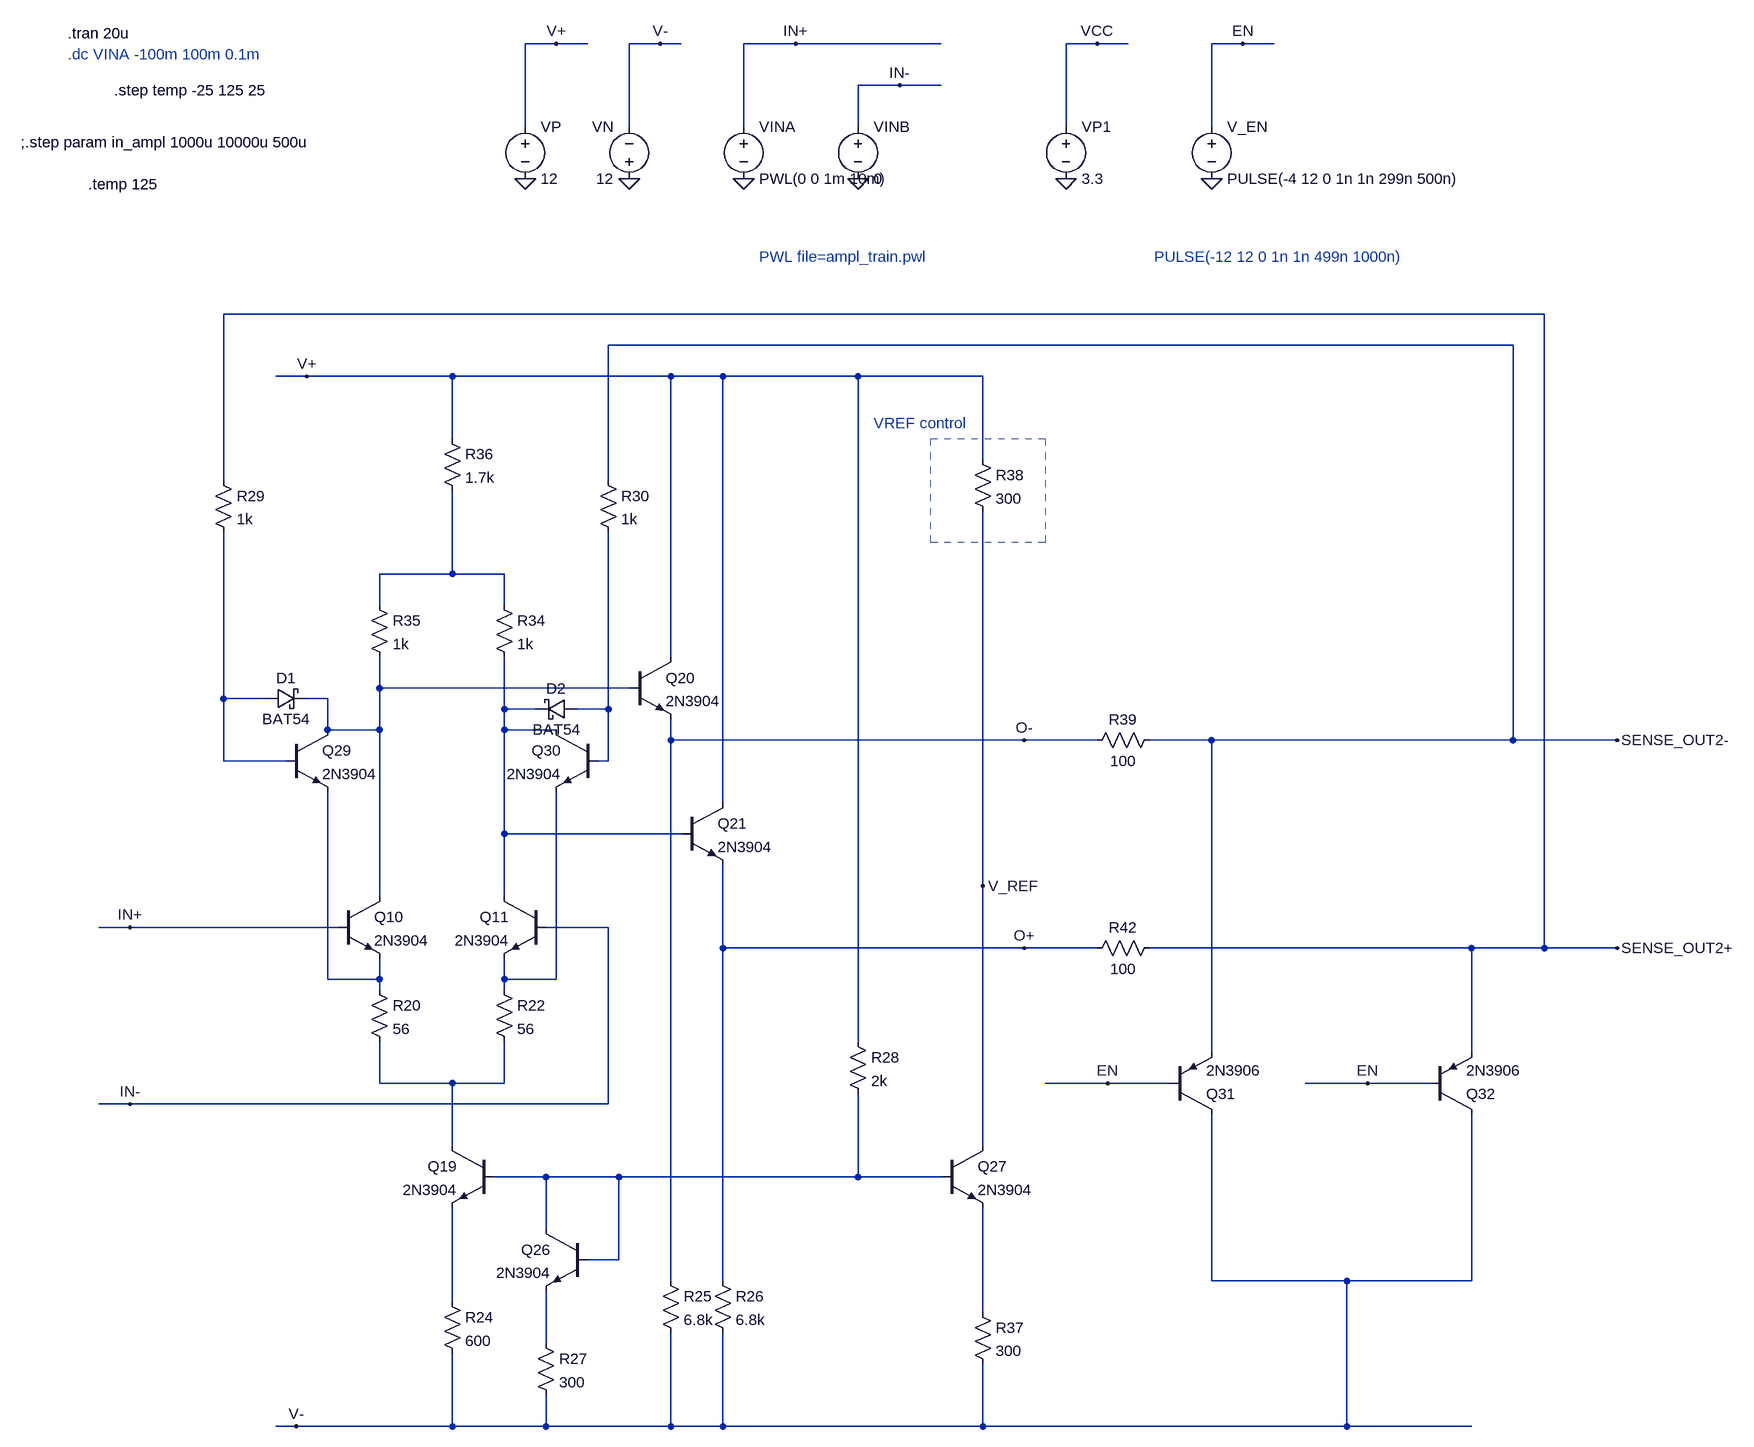
[diagram p0: schematic rom_sense_amp.asc]
rom_sense_amp.asc, the LTspice schematic file:
Version 4.1
SHEET 1 4868 3272
WIRE 448 992 400 992
WIRE 496 992 448 992
WIRE 608 992 560 992
WIRE 640 992 608 992
WIRE 816 992 736 992
WIRE 1040 992 816 992
WIRE 1280 992 1232 992
WIRE 1328 992 1280 992
WIRE 1504 992 1456 992
WIRE 1552 992 1504 992
WIRE 976 1056 912 1056
WIRE 1040 1056 976 1056
WIRE 400 1120 400 992
WIRE 560 1120 560 992
WIRE 736 1120 736 992
WIRE 912 1120 912 1056
WIRE 1232 1120 1232 992
WIRE 1456 1120 1456 992
WIRE 1968 1408 -64 1408
WIRE 1920 1456 528 1456
WIRE 64 1504 16 1504
WIRE 288 1504 64 1504
WIRE 624 1504 288 1504
WIRE 704 1504 624 1504
WIRE 912 1504 704 1504
WIRE 1104 1504 912 1504
WIRE 288 1600 288 1504
WIRE 1104 1632 1104 1504
WIRE -64 1664 -64 1408
WIRE 528 1664 528 1456
WIRE 288 1808 288 1680
WIRE 288 1808 176 1808
WIRE 368 1808 288 1808
WIRE 176 1856 176 1808
WIRE 368 1856 368 1808
WIRE 624 1936 624 1504
WIRE 176 1984 176 1936
WIRE 560 1984 176 1984
WIRE -64 2000 -64 1744
WIRE 0 2000 -64 2000
WIRE 96 2000 64 2000
WIRE 368 2016 368 1936
WIRE 416 2016 368 2016
WIRE 528 2016 528 1744
WIRE 528 2016 480 2016
WIRE 96 2048 96 2000
WIRE 176 2048 176 1984
WIRE 176 2048 96 2048
WIRE 368 2048 368 2016
WIRE 448 2048 368 2048
WIRE 624 2064 624 2032
WIRE 1168 2064 624 2064
WIRE 1280 2064 1168 2064
WIRE 1456 2064 1360 2064
WIRE 1920 2064 1920 1456
WIRE 1920 2064 1456 2064
WIRE 2080 2064 1920 2064
WIRE -64 2096 -64 2000
WIRE 32 2096 -64 2096
WIRE 528 2096 528 2016
WIRE 528 2096 512 2096
WIRE 704 2160 704 1504
WIRE 368 2208 368 2048
WIRE 640 2208 368 2208
WIRE 1104 2288 1104 1712
WIRE 176 2304 176 2048
WIRE 368 2304 368 2208
WIRE -208 2352 -256 2352
WIRE 112 2352 -208 2352
WIRE 528 2352 432 2352
WIRE 704 2384 704 2256
WIRE 1168 2384 704 2384
WIRE 1280 2384 1168 2384
WIRE 1856 2384 1360 2384
WIRE 1968 2384 1968 1408
WIRE 1968 2384 1856 2384
WIRE 2080 2384 1968 2384
WIRE 96 2432 96 2144
WIRE 176 2432 176 2400
WIRE 176 2432 96 2432
WIRE 368 2432 368 2400
WIRE 448 2432 448 2144
WIRE 448 2432 368 2432
WIRE 176 2448 176 2432
WIRE 368 2448 368 2432
WIRE 912 2528 912 1504
WIRE 1456 2544 1456 2064
WIRE 1856 2544 1856 2384
WIRE 176 2592 176 2528
WIRE 288 2592 176 2592
WIRE 368 2592 368 2528
WIRE 368 2592 288 2592
WIRE 1296 2592 1200 2592
WIRE 1392 2592 1296 2592
WIRE 1696 2592 1600 2592
WIRE 1792 2592 1696 2592
WIRE -208 2624 -256 2624
WIRE 528 2624 528 2352
WIRE 528 2624 -208 2624
WIRE 288 2688 288 2592
WIRE 1104 2688 1104 2288
WIRE 432 2736 352 2736
WIRE 544 2736 432 2736
WIRE 912 2736 912 2608
WIRE 912 2736 544 2736
WIRE 1040 2736 912 2736
WIRE 432 2816 432 2736
WIRE 544 2864 544 2736
WIRE 544 2864 496 2864
WIRE 624 2896 624 2064
WIRE 704 2896 704 2384
WIRE 1456 2896 1456 2640
WIRE 1664 2896 1456 2896
WIRE 1856 2896 1856 2640
WIRE 1856 2896 1664 2896
WIRE 288 2928 288 2784
WIRE 1104 2944 1104 2784
WIRE 432 2992 432 2912
WIRE 48 3120 16 3120
WIRE 288 3120 288 3008
WIRE 288 3120 48 3120
WIRE 432 3120 432 3072
WIRE 432 3120 288 3120
WIRE 624 3120 624 2976
WIRE 624 3120 432 3120
WIRE 704 3120 704 2976
WIRE 704 3120 624 3120
WIRE 1104 3120 1104 3024
WIRE 1104 3120 704 3120
WIRE 1664 3120 1664 2896
WIRE 1664 3120 1104 3120
WIRE 1856 3120 1664 3120
FLAG 400 1200 0
FLAG 736 1200 0
FLAG 560 1200 0
FLAG 912 1200 0
FLAG 448 992 V+
FLAG 608 992 V-
FLAG 816 992 IN+
FLAG 976 1056 IN-
FLAG 1232 1200 0
FLAG 1280 992 VCC
FLAG 1456 1200 0
FLAG 1504 992 EN
FLAG 2080 2064 SENSE_OUT2-
FLAG -208 2352 IN+
FLAG -208 2624 IN-
FLAG 64 1504 V+
FLAG 48 3120 V-
FLAG 1104 2288 V_REF
FLAG 2080 2384 SENSE_OUT2+
FLAG 1296 2592 EN
FLAG 1696 2592 EN
FLAG 1168 2064 O-
FLAG 1168 2384 O+
SYMBOL voltage 400 1104 R0
SYMATTR InstName VP
SYMATTR Value 12
SYMBOL voltage 560 1216 R180
WINDOW 0 24 96 Left 2
WINDOW 3 24 16 Left 2
SYMATTR InstName VN
SYMATTR Value 12
SYMBOL voltage 736 1104 R0
WINDOW 123 0 0 Left 0
WINDOW 39 0 0 Left 0
SYMATTR InstName VINA
SYMATTR Value PWL(0 0 1m 10m)
SYMBOL voltage 912 1104 R0
WINDOW 123 0 0 Left 0
WINDOW 39 0 0 Left 0
SYMATTR InstName VINB
SYMATTR Value 0
SYMBOL voltage 1232 1104 R0
SYMATTR InstName VP1
SYMATTR Value 3.3
SYMBOL voltage 1456 1104 R0
WINDOW 123 0 0 Left 0
WINDOW 39 0 0 Left 0
SYMATTR InstName V_EN
SYMATTR Value PULSE(-4 12 0 1n 1n 299n 500n)
SYMBOL npn 112 2304 R0
SYMATTR InstName Q10
SYMATTR Value 2N3904
SYMBOL res 160 2432 R0
SYMATTR InstName R20
SYMATTR Value 56
SYMBOL res 352 2432 R0
SYMATTR InstName R22
SYMATTR Value 56
SYMBOL npn 432 2304 M0
SYMATTR InstName Q11
SYMATTR Value 2N3904
SYMBOL npn 352 2688 M0
SYMATTR InstName Q19
SYMATTR Value 2N3904
SYMBOL npn 560 1936 R0
SYMATTR InstName Q20
SYMATTR Value 2N3904
SYMBOL npn 640 2160 R0
SYMATTR InstName Q21
SYMATTR Value 2N3904
SYMBOL res 272 2912 R0
SYMATTR InstName R24
SYMATTR Value 600
SYMBOL res 608 2880 R0
SYMATTR InstName R25
SYMATTR Value 6.8k
SYMBOL res 688 2880 R0
SYMATTR InstName R26
SYMATTR Value 6.8k
SYMBOL res 416 2976 R0
SYMATTR InstName R27
SYMATTR Value 300
SYMBOL res 352 1840 R0
SYMATTR InstName R34
SYMATTR Value 1k
SYMBOL res 160 1840 R0
SYMATTR InstName R35
SYMATTR Value 1k
SYMBOL res 272 1584 R0
SYMATTR InstName R36
SYMATTR Value 1.7k
SYMBOL npn 496 2816 M0
SYMATTR InstName Q26
SYMATTR Value 2N3904
SYMBOL npn 1040 2688 R0
SYMATTR InstName Q27
SYMATTR Value 2N3904
SYMBOL res 1088 2928 R0
SYMATTR InstName R37
SYMATTR Value 300
SYMBOL res 1088 1616 R0
SYMATTR InstName R38
SYMATTR Value 300
SYMBOL res 1376 2048 R90
WINDOW 0 0 56 VBottom 2
WINDOW 3 32 56 VTop 2
SYMATTR InstName R39
SYMATTR Value 100
SYMBOL res 1376 2368 R90
WINDOW 0 0 56 VBottom 2
WINDOW 3 32 56 VTop 2
SYMATTR InstName R42
SYMATTR Value 100
SYMBOL npn 32 2048 R0
SYMATTR InstName Q29
SYMATTR Value 2N3904
SYMBOL npn 512 2048 M0
SYMATTR InstName Q30
SYMATTR Value 2N3904
SYMBOL pnp 1392 2640 M180
SYMATTR InstName Q31
SYMATTR Value 2N3906
SYMBOL pnp 1792 2640 M180
SYMATTR InstName Q32
SYMATTR Value 2N3906
SYMBOL res 896 2512 R0
SYMATTR InstName R28
SYMATTR Value 2k
SYMBOL schottky 0 2016 R270
WINDOW 0 32 32 VTop 2
WINDOW 3 0 32 VBottom 2
SYMATTR InstName D1
SYMATTR Value BAT54
SYMATTR Description Diode
SYMATTR Type diode
SYMBOL schottky 480 2032 M270
WINDOW 0 32 32 VTop 2
WINDOW 3 0 32 VBottom 2
SYMATTR InstName D2
SYMATTR Value BAT54
SYMATTR Description Diode
SYMATTR Type diode
SYMBOL res -80 1648 R0
SYMATTR InstName R29
SYMATTR Value 1k
SYMBOL res 512 1648 R0
SYMATTR InstName R30
SYMATTR Value 1k
TEXT -304 976 Left 2 !.tran 20u
TEXT -304 1008 Left 2 ;.dc VINA -100m 100m 0.1m
TEXT -232 1064 Left 2 !.step temp -25 125 25
TEXT 1368 1320 Left 2 ;PULSE(-12 12 0 1n 1n 499n 1000n)
TEXT 760 1320 Left 2 ;PWL file=ampl_train.pwl
TEXT 936 1576 Left 2 ;VREF control
TEXT -376 1144 Left 2 !;.step param in_ampl 1000u 10000u 500u
TEXT -272 1208 Left 2 !.temp 125
RECTANGLE Normal 1200 1760 1024 1600 2

The netlist it stands for:
* rom_sense_amp.asc
VP V+ 0 12
VN 0 V- 12
VINA IN+ 0 PWL(0 0 1m 10m)
VINB IN- 0 0
VP1 VCC 0 3.3
V_EN EN 0 PULSE(-4 12 0 1n 1n 299n 500n)
Q10 N002 IN+ N006 0 2N3904
R20 N006 N008 56
R22 N007 N008 56
Q11 N004 IN- N007 0 2N3904
Q19 N008 N009 N010 0 2N3904
Q20 V+ N002 O- 0 2N3904
Q21 V+ N004 O+ 0 2N3904
R24 N010 V- 600
R25 O- V- 6.8k
R26 O+ V- 6.8k
R27 N012 V- 300
R34 N001 N004 1k
R35 N001 N002 1k
R36 V+ N001 1.7k
Q26 N009 N009 N012 0 2N3904
Q27 V_REF N009 N011 0 2N3904
R37 N011 V- 300
R38 V+ V_REF 300
R39 SENSE_OUT2- O- 100
R42 SENSE_OUT2+ O+ 100
Q29 N002 N003 N006 0 2N3904
Q30 N004 N005 N007 0 2N3904
Q31 V- EN SENSE_OUT2- 0 2N3906
Q32 V- EN SENSE_OUT2+ 0 2N3906
R28 V+ N009 2k
D1 N003 N002 BAT54
D2 N005 N004 BAT54
R29 SENSE_OUT2+ N003 1k
R30 SENSE_OUT2- N005 1k
.model D D
.lib standard.dio
.model NPN NPN
.model PNP PNP
.lib standard.bjt
.tran 20u
* .dc VINA -100m 100m 0.1m
.step temp -25 125 25
* PULSE(-12 12 0 1n 1n 499n 1000n)
* PWL file=ampl_train.pwl
* VREF control
;.step param in_ampl 1000u 10000u 500u
.temp 125
.backanno
.end